# Altium schematic sheet DCSource3V3.SchDoc
size A4; DocumentNumber: 2; SheetNumber: 2; SheetTotal: 5
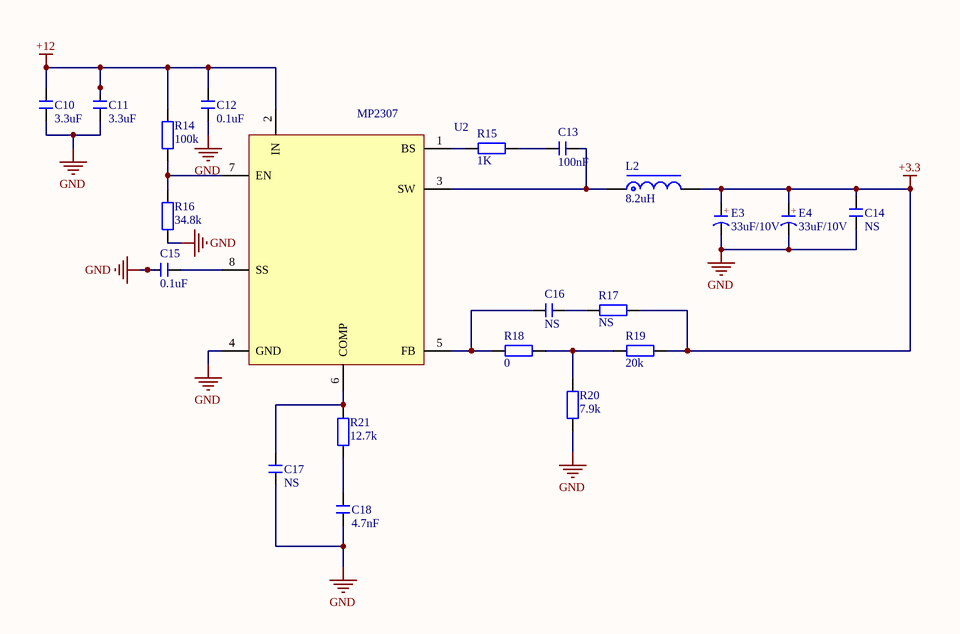
[diagram p0: DCSource3V3.SchDoc]

## Parts
C10  3.3uF  [C 0805_L]
C11  3.3uF  [C 0805_L]
C12  0.1uF  [C 0805_L]
C13  100nF  [C 0805_L]
C14  NS  [C 0805_L]
C15  0.1uF  [C 0805_L]
C16  NS  [C 0805_L]
C17  NS  [C 0805_L]
C18  4.7nF  [C 0805_L]
E3  33uF/10V  [CT 5*6 - C]
E4  33uF/10V  [CT 5*6 - C]
L2  8.2uH  [CD31]
R14  100k  [R 0805_L]
R15  1K  [R 0805_L]
R16  34.8k  [R 0805_L]
R17  NS  [R 0805_L]
R18  0  [R 0805_L]
R19  20k  [R 0805_L]
R20  7.9k  [R 0805_L]
R21  12.7k  [R 0805_L]
U2  MP2307  [SOP8_M]

## Nets
+3.3: C14.2 E3.1(A) E4.1(A) L2.2 R17.1 R19.2
+12: C10.2 C11.2 C12.2 R14.2 U2.2(IN)
GND: C10.1 C11.1 C12.1 C14.1 C15.2 C17.1 C18.1 E3.2(K) E4.2(K) R16.1 R20.1 U2.4(GND)
NetC13_1: C13.1 R15.2
NetC13_2: C13.2 L2.1 U2.3(SW)
NetC15_1: C15.1 U2.8(SS)
NetC16_1: C16.1 R18.1 U2.5(FB)
NetC16_2: C16.2 R17.2
NetC17_2: C17.2 R21.2 U2.6(COMP)
NetC18_2: C18.2 R21.1
NetR14_1: R14.1 R16.2 U2.7(EN)
NetR15_1: R15.1 U2.1(BS)
NetR18_2: R18.2 R19.1 R20.2

## Notes on the sheet
- (in symbol C-CT) +

## Library data of the parts
C10-C18 = C: 无极性贴片电容; 材质: X7R; BOM名称: 无极性贴片电容
E3 E4 = C-CT: 贴片固态电容; BOM名称: 贴片固态电容
L2 = L-CD: 贴片功率电感; BOM名称: 功率电感
R14-R21 = R: 贴片电阻; BOM名称: 贴片电阻
U2 = Component_1